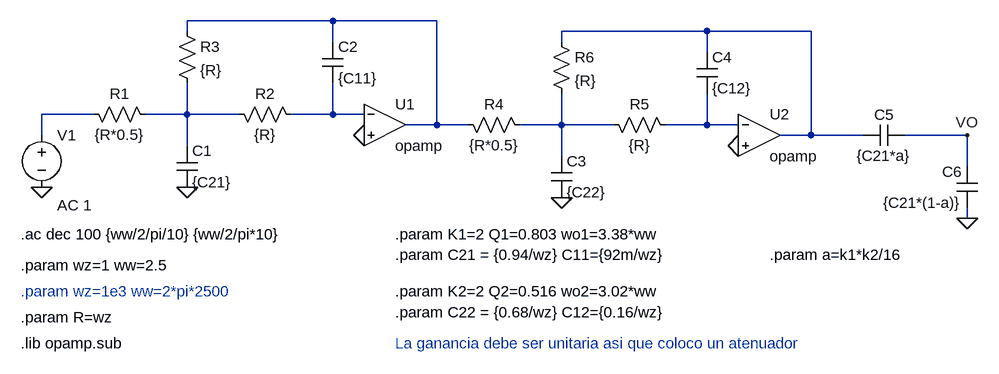
[diagram p0: schematic Ej6.asc]
Ej6.asc, the LTspice schematic file:
Version 4
SHEET 1 1848 680
WIRE 368 0 144 0
WIRE 528 0 368 0
WIRE 144 16 144 0
WIRE 944 16 720 16
WIRE 1104 16 944 16
WIRE 368 32 368 0
WIRE 720 32 720 16
WIRE 944 48 944 16
WIRE 0 144 -80 144
WIRE 144 144 144 96
WIRE 144 144 80 144
WIRE 224 144 144 144
WIRE 368 144 368 96
WIRE 368 144 304 144
WIRE 416 144 368 144
WIRE 528 160 528 0
WIRE 528 160 480 160
WIRE 576 160 528 160
WIRE 720 160 720 112
WIRE 720 160 656 160
WIRE 800 160 720 160
WIRE 944 160 944 112
WIRE 944 160 880 160
WIRE 992 160 944 160
WIRE -80 176 -80 144
WIRE 1104 176 1104 16
WIRE 1104 176 1056 176
WIRE 1184 176 1104 176
WIRE 1344 176 1248 176
WIRE 144 192 144 144
WIRE 720 208 720 160
WIRE 1344 224 1344 176
WIRE 1344 304 1344 288
FLAG 416 176 0
FLAG 144 256 0
FLAG -80 256 0
FLAG 992 192 0
FLAG 720 272 0
FLAG 1344 304 0
FLAG 1344 176 VO
SYMBOL res 96 160 M270
WINDOW 0 32 56 VTop 2
WINDOW 3 0 56 VBottom 2
SYMATTR InstName R1
SYMATTR Value {R*0.5}
SYMBOL res 320 160 M270
WINDOW 0 32 56 VTop 2
WINDOW 3 0 56 VBottom 2
SYMATTR InstName R2
SYMATTR Value {R}
SYMBOL res 128 0 R0
SYMATTR InstName R3
SYMATTR Value {R}
SYMBOL cap 128 192 R0
SYMATTR InstName C1
SYMATTR Value {C21}
SYMBOL cap 352 32 R0
SYMATTR InstName C2
SYMATTR Value {C11}
SYMBOL OpAmps\\opamp 448 96 R0
SYMATTR InstName U1
SYMBOL voltage -80 160 R0
WINDOW 123 24 124 Left 2
WINDOW 39 0 0 Left 0
SYMATTR InstName V1
SYMATTR Value ""
SYMATTR Value2 AC 1
SYMBOL res 672 176 M270
WINDOW 0 32 56 VTop 2
WINDOW 3 0 56 VBottom 2
SYMATTR InstName R4
SYMATTR Value {R*0.5}
SYMBOL res 896 176 M270
WINDOW 0 32 56 VTop 2
WINDOW 3 0 56 VBottom 2
SYMATTR InstName R5
SYMATTR Value {R}
SYMBOL res 704 16 R0
SYMATTR InstName R6
SYMATTR Value {R}
SYMBOL cap 704 208 R0
SYMATTR InstName C3
SYMATTR Value {C22}
SYMBOL cap 928 48 R0
SYMATTR InstName C4
SYMATTR Value {C12}
SYMBOL OpAmps\\opamp 1024 112 R0
SYMATTR InstName U2
SYMBOL cap 1248 160 R90
WINDOW 0 0 32 VBottom 2
WINDOW 3 32 32 VTop 2
SYMATTR InstName C5
SYMATTR Value {C21*a}
SYMBOL cap 1360 288 R180
WINDOW 0 24 56 Left 2
WINDOW 3 24 8 Left 2
SYMATTR InstName C6
SYMATTR Value {C21*(1-a)}
TEXT -112 496 Left 2 !.lib opamp.sub
TEXT -112 328 Left 2 !.ac dec 100 {ww/2/pi/10} {ww/2/pi*10}
TEXT -112 456 Left 2 !.param R=wz
TEXT 464 328 Left 2 !.param K1=2 Q1=0.803 wo1=3.38*ww
TEXT 464 360 Left 2 !.param C21 = {0.94/wz} C11={92m/wz}
TEXT 464 416 Left 2 !.param K2=2 Q2=0.516 wo2=3.02*ww
TEXT 464 448 Left 2 !.param C22 = {0.68/wz} C12={0.16/wz}
TEXT -112 416 Left 2 ;.param wz=1e3 ww=2*pi*2500
TEXT -112 376 Left 2 !.param wz=1 ww=2.5
TEXT 1040 360 Left 2 !.param a=k1*k2/16
TEXT 464 496 Left 2 ;La ganancia debe ser unitaria asi que coloco un atenuador

The netlist it stands for:
* Ej6.asc
R1 N004 N003 {R*0.5}
R2 N005 N004 {R}
R3 N001 N004 {R}
C1 N004 0 {C21}
C2 N001 N005 {C11}
XU1 N005 0 N001 opamp Aol=100K GBW=10Meg  ; pins invin noninvin out
V1 N003 0 AC 1
R4 N006 N001 {R*0.5}
R5 N007 N006 {R}
R6 N002 N006 {R}
C3 N006 0 {C22}
C4 N002 N007 {C12}
XU2 N007 0 N002 opamp Aol=100K GBW=10Meg  ; pins invin noninvin out
C5 VO N002 {C21*a}
C6 0 VO {C21*(1-a)}
.lib opamp.sub
.ac dec 100 {ww/2/pi/10} {ww/2/pi*10}
.param R=wz
.param K1=2 Q1=0.803 wo1=3.38*ww
.param C21 = {0.94/wz} C11={92m/wz}
.param K2=2 Q2=0.516 wo2=3.02*ww
.param C22 = {0.68/wz} C12={0.16/wz}
* .param wz=1e3 ww=2*pi*2500
.param wz=1 ww=2.5
.param a=k1*k2/16
* La ganancia debe ser unitaria asi que coloco un atenuador
.backanno
.end